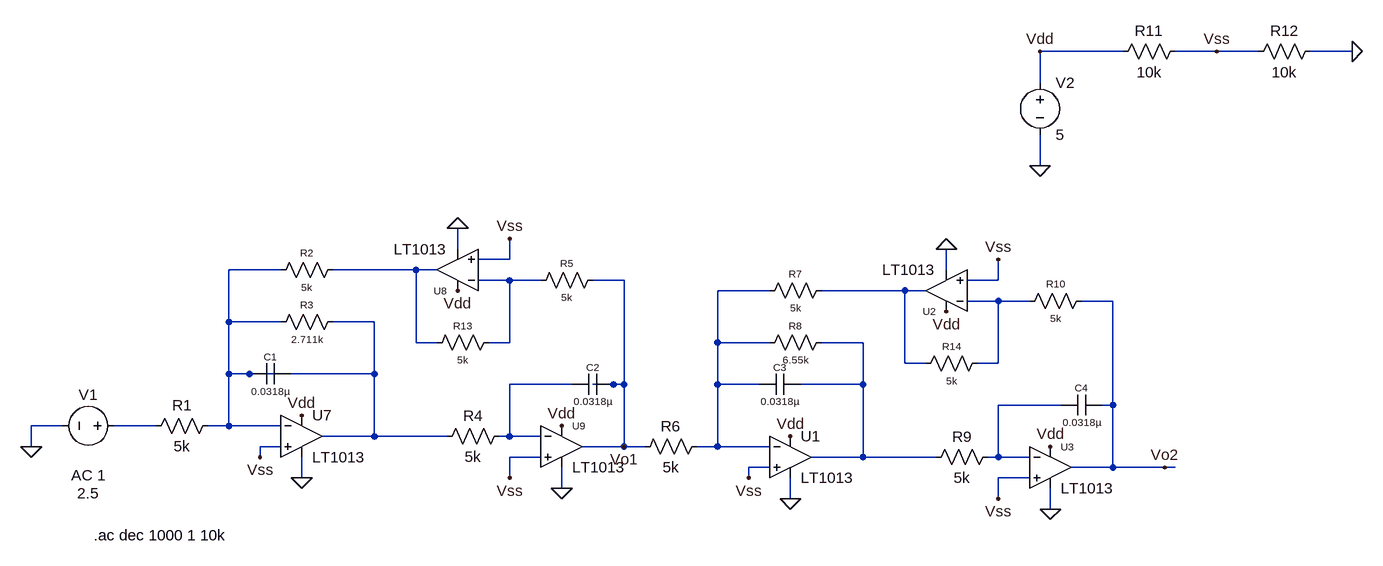
[diagram p0: schematic RC_maximallyflat_low-pass_flter.asc]
RC_maximallyflat_low-pass_flter.asc, the LTspice schematic file:
Version 4
SHEET 1 1836 680
WIRE 816 -416 688 -416
WIRE 960 -416 896 -416
WIRE 1024 -416 960 -416
WIRE 1168 -416 1104 -416
WIRE 688 -368 688 -416
WIRE 688 -240 688 -288
WIRE -208 -112 -208 -144
WIRE -128 -96 -128 -128
WIRE -128 -96 -176 -96
WIRE -480 -80 -560 -80
WIRE -272 -80 -400 -80
WIRE -240 -80 -272 -80
WIRE 544 -80 544 -112
WIRE -128 -64 -176 -64
WIRE -80 -64 -128 -64
WIRE 48 -64 0 -64
WIRE 624 -64 624 -96
WIRE 624 -64 576 -64
WIRE 272 -48 192 -48
WIRE 480 -48 352 -48
WIRE 512 -48 480 -48
WIRE 624 -32 576 -32
WIRE 672 -32 624 -32
WIRE 800 -32 752 -32
WIRE -560 0 -560 -80
WIRE -480 0 -560 0
WIRE -336 0 -400 0
WIRE -272 32 -272 -80
WIRE -240 32 -272 32
WIRE -128 32 -128 -64
WIRE -128 32 -160 32
WIRE 192 32 192 -48
WIRE 272 32 192 32
WIRE 416 32 352 32
WIRE 480 64 480 -48
WIRE 512 64 480 64
WIRE 624 64 624 -32
WIRE 624 64 592 64
WIRE -560 80 -560 0
WIRE -528 80 -560 80
WIRE -480 80 -528 80
WIRE -336 80 -336 0
WIRE -336 80 -464 80
WIRE -32 96 -128 96
WIRE 32 96 0 96
WIRE 48 96 48 -64
WIRE 48 96 32 96
WIRE 192 96 192 32
WIRE 256 96 192 96
WIRE 416 96 416 32
WIRE 416 96 320 96
WIRE 720 128 624 128
WIRE 800 128 800 -32
WIRE 800 128 784 128
WIRE -816 160 -864 160
WIRE -672 160 -736 160
WIRE -560 160 -560 80
WIRE -560 160 -592 160
WIRE -480 160 -560 160
WIRE -336 176 -336 80
WIRE -336 176 -416 176
WIRE -224 176 -336 176
WIRE -128 176 -128 96
WIRE -128 176 -144 176
WIRE -80 176 -128 176
WIRE -864 192 -864 160
WIRE -480 192 -512 192
WIRE 48 192 48 96
WIRE 48 192 -16 192
WIRE 80 192 48 192
WIRE 192 192 192 96
WIRE 192 192 160 192
WIRE 272 192 192 192
WIRE -512 208 -512 192
WIRE -80 208 -128 208
WIRE 416 208 416 96
WIRE 416 208 336 208
WIRE 528 208 416 208
WIRE 624 208 624 128
WIRE 624 208 608 208
WIRE 672 208 624 208
WIRE 272 224 240 224
WIRE 800 224 800 128
WIRE 800 224 736 224
WIRE 880 224 800 224
WIRE 896 224 880 224
WIRE -448 240 -448 208
WIRE -128 240 -128 208
WIRE 240 240 240 224
WIRE 672 240 624 240
WIRE -48 256 -48 224
WIRE 304 272 304 240
WIRE 624 272 624 240
WIRE 704 288 704 256
FLAG 304 272 0
FLAG 704 288 0
FLAG 240 240 Vss
FLAG 624 272 Vss
FLAG 704 192 Vdd
FLAG 544 -16 Vdd
FLAG 544 -112 0
FLAG 304 176 Vdd
FLAG 1168 -416 0
FLAG 688 -240 0
FLAG 688 -416 Vdd
FLAG 960 -416 Vss
FLAG 624 -96 Vss
FLAG -448 240 0
FLAG -48 256 0
FLAG -512 208 Vss
FLAG -128 240 Vss
FLAG -448 144 Vdd
FLAG -48 160 Vdd
FLAG -208 -48 Vdd
FLAG -208 -144 0
FLAG -128 -128 Vss
FLAG -864 192 0
FLAG 880 224 Vo2
FLAG 48 192 Vo1
SYMBOL Opamps\\LT1013 304 144 R0
SYMATTR InstName U1
SYMBOL res 368 -64 R90
WINDOW 0 0 56 VBottom 1
WINDOW 3 32 56 VTop 1
SYMATTR InstName R7
SYMATTR Value 5k
SYMBOL res 368 16 R90
WINDOW 0 0 56 VBottom 1
WINDOW 3 32 56 VTop 1
SYMATTR InstName R8
SYMATTR Value 6.55k
SYMBOL Opamps\\LT1013 544 16 R180
WINDOW 0 16 32 Left 1
SYMATTR InstName U2
SYMBOL res 768 -48 R90
WINDOW 0 0 56 VBottom 1
WINDOW 3 32 56 VTop 1
SYMATTR InstName R10
SYMATTR Value 5k
SYMBOL res 624 192 R90
WINDOW 0 0 56 VBottom 2
WINDOW 3 32 56 VTop 2
SYMATTR InstName R9
SYMATTR Value 5k
SYMBOL Opamps\\LT1013 704 160 R0
WINDOW 0 16 32 Left 1
SYMATTR InstName U3
SYMBOL cap 320 80 R90
WINDOW 0 0 32 VBottom 1
WINDOW 3 32 32 VTop 1
SYMATTR InstName C3
SYMATTR Value 0.0318µ
SYMBOL res 608 48 R90
WINDOW 0 0 56 VBottom 1
WINDOW 3 32 56 VTop 1
SYMATTR InstName R14
SYMATTR Value 5k
SYMBOL cap 784 112 R90
WINDOW 0 0 32 VBottom 1
WINDOW 3 32 32 VTop 1
SYMATTR InstName C4
SYMATTR Value 0.0318µ
SYMBOL voltage 688 -384 R0
WINDOW 123 0 0 Left 0
WINDOW 39 0 0 Left 0
SYMATTR InstName V2
SYMATTR Value 5
SYMBOL res 912 -432 R90
WINDOW 0 0 56 VBottom 2
WINDOW 3 32 56 VTop 2
SYMATTR InstName R11
SYMATTR Value 10k
SYMBOL res 1120 -432 R90
WINDOW 0 0 56 VBottom 2
WINDOW 3 32 56 VTop 2
SYMATTR InstName R12
SYMATTR Value 10k
SYMBOL Opamps\\LT1013 -448 112 R0
SYMATTR InstName U7
SYMBOL res -384 -96 R90
WINDOW 0 0 56 VBottom 1
WINDOW 3 32 56 VTop 1
SYMATTR InstName R2
SYMATTR Value 5k
SYMBOL res -384 -16 R90
WINDOW 0 0 56 VBottom 1
WINDOW 3 32 56 VTop 1
SYMATTR InstName R3
SYMATTR Value 2.711k
SYMBOL Opamps\\LT1013 -208 -16 R180
WINDOW 0 16 32 Left 1
SYMATTR InstName U8
SYMBOL res 16 -80 R90
WINDOW 0 0 56 VBottom 1
WINDOW 3 32 56 VTop 1
SYMATTR InstName R5
SYMATTR Value 5k
SYMBOL res -128 160 R90
WINDOW 0 0 56 VBottom 2
WINDOW 3 32 56 VTop 2
SYMATTR InstName R4
SYMATTR Value 5k
SYMBOL Opamps\\LT1013 -48 128 R0
WINDOW 0 16 32 Left 1
SYMATTR InstName U9
SYMBOL res -144 16 R90
WINDOW 0 0 56 VBottom 1
WINDOW 3 32 56 VTop 1
SYMATTR InstName R13
SYMATTR Value 5k
SYMBOL cap -464 64 R90
WINDOW 0 0 32 VBottom 1
WINDOW 3 32 32 VTop 1
SYMATTR InstName C1
SYMATTR Value 0.0318µ
SYMBOL cap 32 80 R90
WINDOW 0 0 32 VBottom 1
WINDOW 3 32 32 VTop 1
SYMATTR InstName C2
SYMATTR Value 0.0318µ
SYMBOL res 176 176 R90
WINDOW 0 0 56 VBottom 2
WINDOW 3 32 56 VTop 2
SYMATTR InstName R6
SYMATTR Value 5k
SYMBOL res -576 144 R90
WINDOW 0 0 56 VBottom 2
WINDOW 3 32 56 VTop 2
SYMATTR InstName R1
SYMATTR Value 5k
SYMBOL voltage -720 160 R90
WINDOW 0 -32 56 VBottom 2
WINDOW 3 88 56 VTop 2
WINDOW 123 60 56 VTop 2
WINDOW 39 0 0 Left 0
SYMATTR InstName V1
SYMATTR Value 2.5
SYMATTR Value2 AC 1
TEXT -768 328 Left 2 !.ac dec 1000 1 10k

The netlist it stands for:
* RC_maximallyflat_low-pass_flter.asc
XU1 Vss N004 Vdd 0 N008 LT1013  ; pins In+ In- V+ V- OUT
R7 N005 N004 5k
R8 N008 N004 6.55k
XU2 Vss N006 Vdd 0 N005 LT1013  ; pins In+ In- V+ V- OUT
R10 Vo2 N006 5k
R9 N010 N008 5k
XU3 Vss N010 Vdd 0 Vo2 LT1013  ; pins In+ In- V+ V- OUT
C3 N008 N004 0.0318µ
R14 N006 N005 5k
C4 Vo2 N010 0.0318µ
V2 Vdd 0 5
R11 Vss Vdd 10k
R12 0 Vss 10k
XU7 Vss N001 Vdd 0 N007 LT1013  ; pins In+ In- V+ V- OUT
R2 N002 N001 5k
R3 N007 N001 2.711k
XU8 Vss N003 Vdd 0 N002 LT1013  ; pins In+ In- V+ V- OUT
R5 Vo1 N003 5k
R4 N009 N007 5k
XU9 Vss N009 Vdd 0 Vo1 LT1013  ; pins In+ In- V+ V- OUT
R13 N003 N002 5k
C1 N007 N001 0.0318µ
C2 Vo1 N009 0.0318µ
R6 N004 Vo1 5k
R1 N001 N011 5k
V1 N011 0 2.5 AC 1
.ac dec 1000 1 10k
.lib LTC.lib
.backanno
.end